# Altium schematic sheet Busboard_SCH.SchDoc
size A
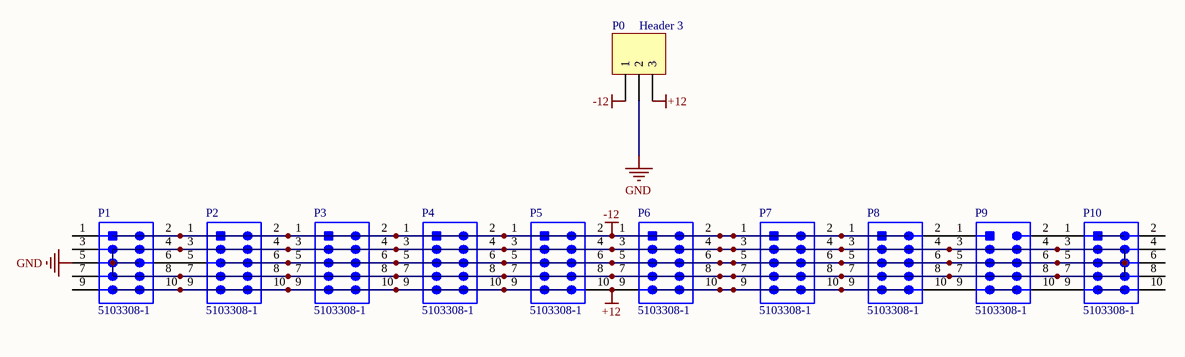
[diagram p0: Busboard_SCH.SchDoc]

## Parts
P0  Header 3  [HDR1X3]
P1  5103308-1  [TECO-5103308-1_V]
P2  5103308-1  [TECO-5103308-1_V]
P3  5103308-1  [TECO-5103308-1_V]
P4  5103308-1  [TECO-5103308-1_V]
P5  5103308-1  [TECO-5103308-1_V]
P6  5103308-1  [TECO-5103308-1_V]
P7  5103308-1  [TECO-5103308-1_V]
P8  5103308-1  [TECO-5103308-1_V]
P9  5103308-1  [TECO-5103308-1_V]
P10  5103308-1  [TECO-5103308-1_V]

## Nets
+12: P0.3 P5.10 P6.9
-12: P0.1 P1.2 P2.1 P2.2 P3.1 P3.2 P4.1 P4.2 P5.1 P5.2 P6.1 P6.2 P7.1 P7.2 P8.1
GND: P0.2 P1.5
NetP1_4: P1.4 P1.8 P2.3 P2.4 P2.6 P2.7 P2.8 P3.3 P3.4 P3.5 P3.6 P3.7 P3.8 P4.3 P4.4 P4.5 P4.6 P4.7 P4.8 P5.3 P5.4 P5.5 P5.6 P5.7 P5.8 P6.3 P6.4 P6.5 P6.6 P6.7 P6.8 P7.3 P7.4 P7.5 P7.6 P7.7 P7.8 P8.3 P8.4 P8.5 P8.6 P8.7 P8.8 P9.3 P9.4 P9.5 P9.6 P9.7 P9.8 P10.3 P10.5 P10.7
NetP1_6: P1.6 P2.5
NetP1_10: P1.10 P2.9 P2.10 P3.9 P3.10 P4.9 P4.10 P5.9
NetP6_10: P6.10 P7.9 P7.10 P8.9
NetP8_2: P8.2 P9.1
NetP8_10: P8.10 P9.9
NetP9_2: P9.2 P10.1
NetP9_10: P9.10 P10.9

Not connected (* = marked no-connect by the designer): P1 1 3 7 9; P10 2 4 6 8 10

## Library data of the parts
P0 = Header 3: Header, 3-Pin; LatestRevisionDate: 17-Jul-2002; LatestRevisionNote: Re-released for DXP Platform.; Publisher: Altium Limited
P1-P10 = CMP-2000-05416-1: Male Header, Pitch 2.54 mm, 2 x 5 Position, Height 9.85 mm, Tail Length 3.05 mm, RoHS, Tube; Manufacturer: TE Connectivity; Pitch: 0.100"(2.54mm); Mating Products: 1658624-1-ND / -CONNRCPT10POSPOLARGOLD / 1658527-4-ND / -CONNRCPT10POS.100W/STRRELF / 1658527-3-ND / -CONNRCPT10POS.100622SERIES / 1658526-3-ND / -CONNRCPT10POSVERTGOLD / 1658526-5-ND / -609-1041LFFEMSOCKT,LEADFREE / 1658526-4-ND / -609-1030LFFEMSOCKT,LEADFREE / ASC10B-ND / -CONNIDCSOCKET10POSGOLD / ASC10H-ND / -CONNIDCSOCKET10POS15GOLD / AKC10B-ND / -CONNIDCSKT10POSW/POLGOLD / AKC10H-ND / -CONNIDCSKT10POSW/POL15GOLD / More...; Dynamic Catalog: AMP-LatchSeries; Number of Positions Loaded: All; Featured Product: AMP-LATCHRibbonCableConnectors; 3D Model: 5103308-1.pdf; Number of Positions: 10; Other Names: A33159; Catalog Drawings: LowProfileShroudedStraight; Connector Type: Header,Shrouded; Termination: Solder; Contact Finish Thickness: 15µin(0.38µm); Datasheet URL: http://www.onlinecomponents.com/productFiles/mf-AMP/eng_cat_889409_0699_96_.pdf; Standard Package: 125; Number of Rows: 2; Contact Type: MalePin; Mounting Type: ThroughHole; Manufacturer URL: http://www.te.com/; Contact Finish: GoldorGold-Palladium; Family: RectangularConnectors-Headers,MalePins; RoHS Information: 5103308-1StatementofCompliance; Packaging: Tube; Category: Connectors,Interconnects; Datasheet Version: Apr-12; Contact Mating Length: 0.240"(6.10mm); Series: AMP-Latch; Row Spacing: 0.100"(2.54mm); Color: Black